# EAGLE design Camera (EAGLE 9.6.2)
COMPANY: ADAFRUIT INDUSTRIES; DRAWN: KTOWN; REV: A
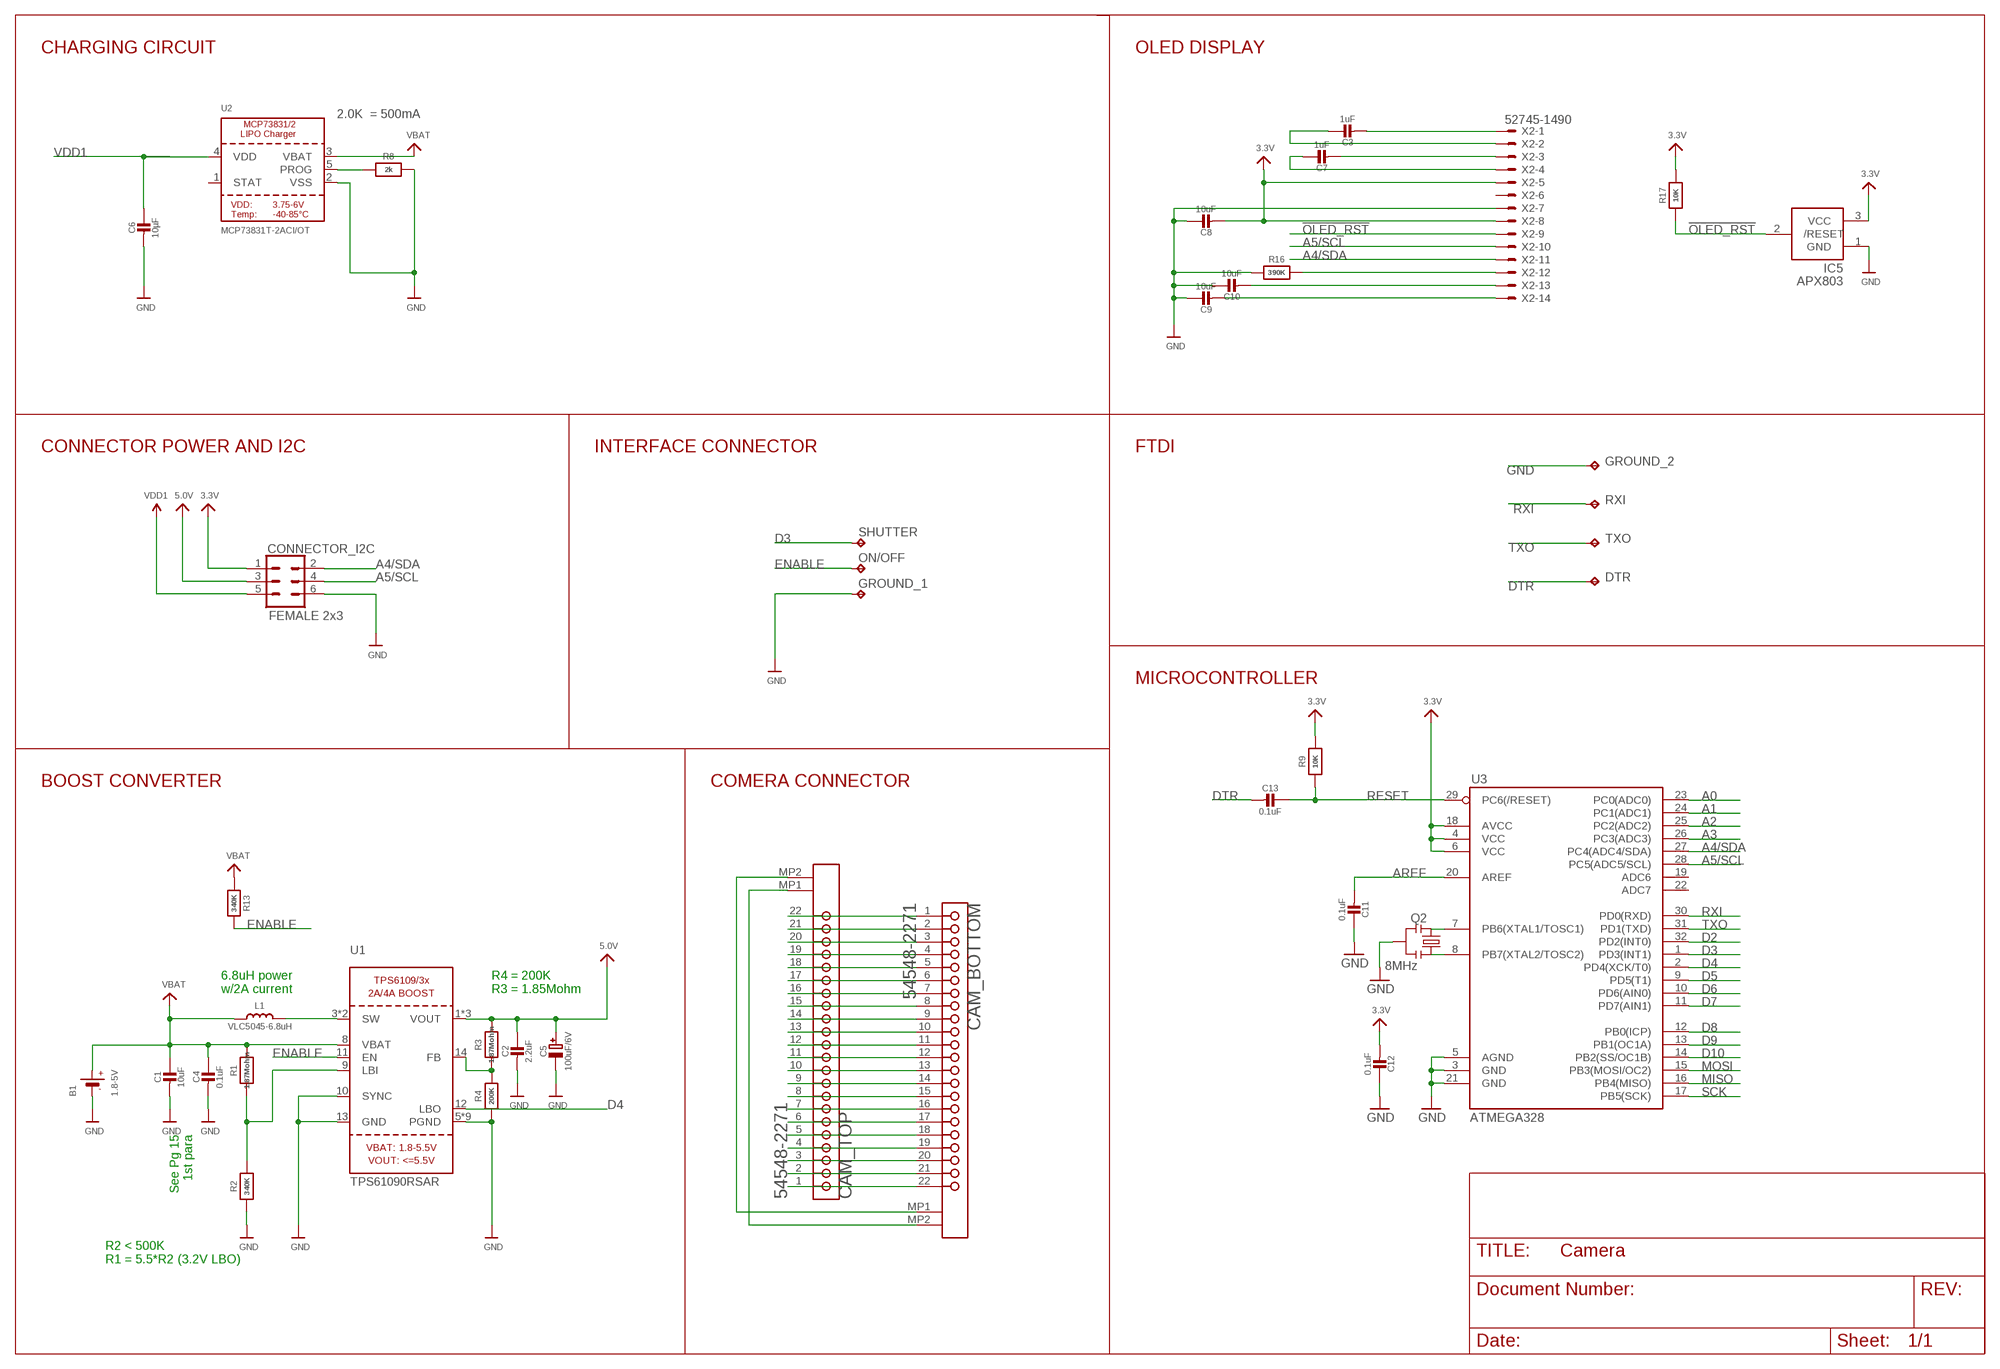
[diagram p0: schematic, sheet 1]

## Parts
B1  1.8-5V  BATTERY  [JSTPH2]
C1  10uF  CAP_CERAMIC0805-NOOUTLINE  [0805-NO]
C2  2.2uF  CAP_CERAMIC0805-NOOUTLINE  [0805-NO]
C3  1uF  CAP_CERAMIC0805-NOOUTLINE  [0805-NO]
C4  0.1uF  CAP_CERAMIC0805-NOOUTLINE  [0805-NO]
C5  100uF/6V  CAP_TANTALUMB/3528_REFLOW  [EIA3528-21/B-R]
C6  10µF  CAP_CERAMIC0805-NOOUTLINE  [0805-NO]
C7  1uF  CAP_CERAMIC0805-NOOUTLINE  [0805-NO]
C8  10uF  CAP_CERAMIC0805-NOOUTLINE  [0805-NO]
C9  10uF  CAP_CERAMIC0805-NOOUTLINE  [0805-NO]
C10  10uF  CAP_CERAMIC0805-NOOUTLINE  [0805-NO]
C11  0.1uF  CAP_CERAMIC0805-NOOUTLINE  [0805-NO]
C12  0.1uF  CAP_CERAMIC0805-NOOUTLINE  [0805-NO]
C13  0.1uF  CAP_CERAMIC0805-NOOUTLINE  [0805-NO]
CAM_BOTTOM  MOLEX_54548-2271MOLEX_54548-2271_0_0  [MOLEX_54548-2271_0]
CAM_TOP  MOLEX_54548-2271MOLEX_54548-2271_0_0  [MOLEX_54548-2271_0]
CONNECTOR_I2C  FEMALE 2x3  CONN_03X2FEMALE  [2X3]
DTR  TPB1,27  [B1,27]
GROUND_1  TPB1,27  [B1,27]
GROUND_2  TPB1,27  [B1,27]
IC5  APX803  AXP083-SAG  [SOT23]
L1  VLC5045-6.8uH  INDUCTORTDK_VLC5045  [INDUCTOR_5X5MM_TDK_VLC5045]
ON/OFF  TPB1,27  [B1,27]
Q2  8MHz  RESONATORSMD  [RESONATOR-SMD]
R1  1.87Mohm  RESISTOR0805_NOOUTLINE  [0805-NO]
R2  340K  RESISTOR0805_NOOUTLINE  [0805-NO]
R3  1.87Mohm  RESISTOR0805_NOOUTLINE  [0805-NO]
R4  200K  RESISTOR0805_NOOUTLINE  [0805-NO]
R8  2k  RESISTOR0805_NOOUTLINE  [0805-NO]
R9  10K  RESISTOR0805_NOOUTLINE  [0805-NO]
R13  340K  RESISTOR0805_NOOUTLINE  [0805-NO]
R16  390K  RESISTOR0805_NOOUTLINE  [0805-NO]
R17  10K  RESISTOR0805_NOOUTLINE  [0805-NO]
RXI  TPB1,27  [B1,27]
SHUTTER  TPB1,27  [B1,27]
TXO  TPB1,27  [B1,27]
U1  TPS61090RSAR  VREG_TPS6103X  [PVQFN-16]
U2  MCP73831T-2ACI/OT  MCP73831/2  [SOT23-5]
U3  ATMEGA328  ATMEGA168  [TQFP32-08]
X2  52745-1490  [52745-1490]

## Nets
3.3V: C8.2 C12.2 CONNECTOR_I2C.1 IC5.3(VCC) R9.2 R17.2 U3.4(VCC) U3.6(VCC) U3.18(AVCC) X2.5 X2.8
5.0V: C2.1 C5.+ CONNECTOR_I2C.3 R3.2 U1.1(VOUT) U1.15(VOUT) U1.16(VOUT)
!OLED_RST: IC5.2(/RESET) R17.1 X2.9
A0: U3.23(PC0(ADC0))
A1: U3.24(PC1(ADC1))
A2: U3.25(PC2(ADC2))
A3: U3.26(PC3(ADC3))
A4/SDA: CONNECTOR_I2C.2 U3.27(PC4(ADC4/SDA)) X2.11
A5/SCL: CONNECTOR_I2C.4 U3.28(PC5(ADC5/SCL)) X2.10
AREF: C11.2 U3.20(AREF)
D2: U3.32(PD2(INT0))
D3: SHUTTER.TP U3.1(PD3(INT1))
D4: U1.12(LBO) U3.2(PD4(XCK/T0))
D5: U3.9(PD5(T1))
D6: U3.10(PD6(AIN0))
D7: U3.11(PD7(AIN1))
D8: U3.12(PB0(ICP))
D9: U3.13(PB1(OC1A))
D10: U3.14(PB2(SS/OC1B))
DTR: C13.2 DTR.TP
ENABLE: ON/OFF.TP R13.2 U1.11(EN)
GND: B1.1(-) C1.2 C2.2 C4.2 C5.- C6.2 C8.1 C9.1 C10.1 C11.1 C12.1 CONNECTOR_I2C.6 GROUND_1.TP GROUND_2.TP IC5.1(GND) Q2.2 R2.1 R4.1 R8.2 R16.1 U1.5(PGND) U1.6(PGND) U1.7(PGND) U1.10(SYNC) U1.13(GND) U1.P$18(PGND) U1.P$19(PGND) U1.P$20(PGND) U1.P$21(PGND) U1.P$22(PGND) U1.THERMAL(PGND) U2.2(VSS) U3.3(GND) U3.5(AGND) U3.21(GND) X2.7
MISO: U3.16(PB4(MISO))
MOSI: U3.15(PB3(MOSI/OC2))
N$1: L1.P$2 U1.3(SW) U1.4(SW)
N$2: CAM_BOTTOM.MP1 CAM_TOP.MP2
N$3: R1.1 R2.2 U1.9(LBI)
N$4: CAM_BOTTOM.MP2 CAM_TOP.MP1
N$5: R3.1 R4.2 U1.14(FB)
N$6: CAM_BOTTOM.1 CAM_TOP.22
N$7: CAM_BOTTOM.2 CAM_TOP.21
N$8: R8.1 U2.5(PROG)
N$9: CAM_BOTTOM.3 CAM_TOP.20
N$10: CAM_BOTTOM.4 CAM_TOP.19
N$11: C3.2 X2.1
N$12: C3.1 X2.2
N$13: C7.2 X2.3
N$14: C7.1 X2.4
N$15: C10.2 X2.13
N$16: R16.2 X2.12
N$17: C9.2 X2.14
N$18: Q2.1 U3.8(PB7(XTAL2/TOSC2))
N$19: Q2.3 U3.7(PB6(XTAL1/TOSC1))
N$20: CAM_BOTTOM.5 CAM_TOP.18
N$21: CAM_BOTTOM.6 CAM_TOP.17
N$22: CAM_BOTTOM.7 CAM_TOP.16
N$23: CAM_BOTTOM.8 CAM_TOP.15
N$24: CAM_BOTTOM.9 CAM_TOP.14
N$25: CAM_BOTTOM.10 CAM_TOP.13
N$26: CAM_BOTTOM.11 CAM_TOP.12
N$27: CAM_BOTTOM.12 CAM_TOP.11
N$28: CAM_BOTTOM.13 CAM_TOP.10
N$29: CAM_BOTTOM.14 CAM_TOP.9
N$30: CAM_BOTTOM.15 CAM_TOP.8
N$31: CAM_BOTTOM.16 CAM_TOP.7
N$32: CAM_BOTTOM.17 CAM_TOP.6
N$33: CAM_BOTTOM.18 CAM_TOP.5
N$34: CAM_BOTTOM.19 CAM_TOP.4
N$35: CAM_BOTTOM.20 CAM_TOP.3
N$36: CAM_BOTTOM.21 CAM_TOP.2
N$37: CAM_BOTTOM.22 CAM_TOP.1
RESET: C13.1 R9.1 U3.29(PC6(/RESET))
RXI: RXI.TP U3.30(PD0(RXD))
SCK: U3.17(PB5(SCK))
TXO: TXO.TP U3.31(PD1(TXD))
VBAT: B1.2(+) C1.1 C4.1 L1.P$1 R1.2 R13.1 U1.8(VBAT) U2.3(VBAT)
VDD1: C6.1 CONNECTOR_I2C.5 U2.4(VDD) ; supply symbol labelled VCC
Unconnected: U2.1(STAT) U3.19(ADC6) U3.22(ADC7) X2.6

## Notes on the sheet
- CHARGING CIRCUIT | OLED DISPLAY
- 2.0K  = 500mA
- CONNECTOR POWER AND I2C | INTERFACE CONNECTOR | FTDI
- MICROCONTROLLER
- BOOST CONVERTER | COMERA CONNECTOR
- 6.8uH power
  w/2A current
- R4 = 200K
  R3 = 1.85Mohm
- See Pg 15
  1st para
- R2 < 500K
  R1 = 5.5*R2 (3.2V LBO)

## Library data of the parts
B1 = microbuilder:BATTERY: CR1220 SMT - Digikey: 3001K-ND CD2032 BAT-HLD-001 - Digikey: BAT-HLD-001-ND
C1-C4 C6-C13 = microbuilder:CAP_CERAMIC: Ceramic Capacitors For new designs, use the packages preceded by an '_' character since they are more reliable: The following footprints should be used on most boards: _0402 - Standard footprint for regular board layouts _0603 - Standard footprint for regular board layouts _0805 - Standard footprint for regular board layouts _1206 - Standard footprint for regular board layouts For extremely tight-pitch boards where space is at a premium, the following 'micro-pitch' footprints can be used (smaller pads, no silkscreen outline, etc.): _0402MP - Micro-pitch footprint for very dense/compact boards _0603MP - Micro-pitch footprint for very dense/compact boards _0805MP - Micro-pitch footprint for very dense/compact boards _1206MP - Micro-pitch footprint for very dense/compact boards
C5 = microbuilder:CAP_TANTALUM: Tantalum Capacitors Wave footprints have larger pads and are meant to be used for hand soldering. Reflow footprints are optimised for solder paste and a reflow oven. EIA3216-18/A-[R/W] - Size A / 3216-18 / 1206 footprint 4.7µF 25V 10% Tantalum Capacitor 10µF 16V 10% Tantalum Capacitor [Digikey: 495-2236-2-ND] EIA3528-21/B-[R/W] - Size B / 3528-21 47µF 10V 10% Tantalum Capactior [Digikey: 495-2216-1-ND] EIA6032-28/C-[R/W] - Size C / 6032-28 10µF 35V 20% Tantalum Capacitor [Digikey: 495-2285-1-ND] 100µF 16V 10% Tantalum Capactior [Digikey: 399-5214-1-ND]
CAM_BOTTOM CAM_TOP = Molex - 54548-2271:MOLEX_54548-2271: MOLX-54548-2271; CIIVA_IDS: 3405268; CIRCUITS_LOADED: 22; COMPONENT_LINK_1_DESCRIPTION: Manufacturer URL; COMPONENT_LINK_1_URL: http://www.molex.com/molex/index.jsp; COMPONENT_LINK_3_DESCRIPTION: Package Specification; COMPONENT_LINK_3_URL: http://www.molex.com/pdm_docs/sd/545482171_sd.pdf; CONTACT_POSITION: Bottom; CURRENT_MAX_PER_CONTACT: 0.5A; DATASHEET: http://www.molex.com/webdocs/datasheets/pdf/en-us/0545482271_FFC_FPC_CONNECTORS.pdf; DURABILITY_MATING_CYCLES_MAX: 20; ENTRY_ANGLE: 90degrees Angle; FOOTPRINT_VARIANT_NAME_0: Manufacturer Recommended; IMPORTED: yes; IMPORTED_FROM: vault; IMPORT_TS: 1521842921; MATED_HEIGHT: 1.20mm; MATERIAL___METAL: Phosphor Bronze; MATERIAL___PLATING_MATING: Gold; MATERIAL___PLATING_TERMINATION: Tin; MF: Molex; MOUNTING_TECHNOLOGY: Surface Mount; MPN: 54548-2271; NUMBER_OF_ROWS: 1; ORIENTATION: Right Angle; PACKAGE: 54548-2271; PACKAGE_DESCRIPTION: 22-Lead FPC Connector, Pitch 0.5 mm; PACKAGE_VERSION: Rev. N, 06/2008; PACKING: Tape and Reel; PCB_LOCATOR: No; PCB_RETENTION: Yes; PITCH___MATING_INTERFACE: 0.50mm; POLARIZED_TO_PCB: Yes; PREFIX: J; RELEASE_DATE: 1411372733; ROHS: Yes; STACKABLE: No; VAULT_GUID: 920E7395-0F54-4537-85AD-D56E07D5A003; VAULT_REVISION: 20E50B2D-1E80-4777-BC1D-DF1542527B45; VOLTAGE_MAX: 50V
CONNECTOR_I2C = SparkFun-Connectors:CONN_03X2: Multi connection point. Often used as Generic Header-pin footprint for 0.1 inch spaced/style header connections You can populate with any combo of single row headers, but if you'd like an exact match, check these: Header - 2x3 (Male, 0.1") <https://www.sparkfun.com/products/12807> (PRT-12807) Header - 2x3 (Female, 0.1") <https://www.sparkfun.com/products/13010> (PRT-13010) 2x3 Pin Shrouded Header <https://www.sparkfun.com/products/10877> (PRT-10877) On any of the 0.1 inch spaced packages, you can populate with these: Break Away Headers - Straight <https://www.sparkfun.com/products/116> (PRT-00116) Break Away Male Headers - Right Angle <https://www.sparkfun.com/products/553> (PRT-00553) Female Headers <https://www.sparkfun.com/products/115> (PRT-00115) Break Away Headers - Machine Pin <https://www.sparkfun.com/products/117> (PRT-00117) Break Away Female Headers - Swiss Machine Pin <https://www.sparkfun.com/products/743> (PRT-00743) Special note: the shrouded connector mates well with our 3x2 ribbon cables: Ribbon Crimp Connector - 6-pin (2x3, Female) <https://www.sparkfun.com/products/10651> (PRT-10651) Ribbon Cable - 6 wire (15ft) <https://www.sparkfun.com/products/10646> (PRT-10646); PROD_ID: CONN-11566
DTR GROUND_1 GROUND_2 ON/OFF RXI SHUTTER TXO = testpad:TP: Test pad
IC5 = adafruit:AXP083
L1 = microbuilder:INDUCTOR: Inductors 0603: 10nH Ceramic Inductor - microwire antenna/RF (Digikey: 712-1434-2-ND) 0805: 560nH Ceramic Inductor - RF (Digikey: 553-1047-1-ND) 270nH Ceramic Inductor - Q = 40@250MHz, +-5%, 1 Ohm DC Resistance (Digikey: 535-10506-2-ND) 1007 (2518 Metric) SMT: 10µH 10% 250mOhm 820mA 1007 Inductor (Digikey: 587-2189-1-ND) 22µH 10% 500mOhm 580mA 1007 Inductor (Digikey: 587-2190-1-ND) 47µH 10% 950mOhm 420mA 1007 Inductor (Digikey: 587-2191-1-ND) 47µH 5% 100mOhm 1A 1008 Inductor (Digikey: 732-1816-1-ND) 5.0x5.0mm (Taiyo Yuden NR5040 Series) 6.8µH 20% 2.3A 64mOhm Inductor (Digikey: 587-2374-2-ND) 5.0x5.0mm (TDK VLC5045 Series) 4.7µH 20% 3.3A 34mOhm Inductor (Digikey: 445-6526-1-ND) 6.8µH 20% 2.7A 46mOhm Inductor (Digikey: 445-6527-1-ND) 6.0x6.0mm (TDK VLC6045 Series) 4.7µH 20% 3.8A 27mOhm Inductor (Digikey: 445-6538-2-ND) 6.8µH 20% 3A 41mOhm Inductor (Digikey: 445-6540-1-ND) 6.2µH 30% 2.2A 45mOhm Inductor (Digikey: SRR5028-6R2YCT-ND) - Not TDK VLC6045 but footprint should match 6.0x6.0mm (TDK SLF6045 Series) 6.8uH 30% 2A 33mOhm Inductor (Digikey: 445-4572-1-ND, Mouser: 810-SLF645T6R8N2R0PF) 6.0x6.0mm (Sumida CDRH5D28 Series) 6.2uH 30% 1.8A 45mOhm Inductor (Digikey: 308-1542-1-ND) Taiyo Yuden NR3015T2R2M - 2.2uH 20% 1.5A (Digikey: 587-1648-2-ND, Mouser: 963-NR3015T2R2M) - Used with TI TPS62172 CoilCraft RFID Transponder Coil - MA5532-AE (For use with AS3935 Lightning Sensor)
Q2 = SparkFun:RESONATOR: Resonator Small SMD resonator. This is the itty bitty 10/20MHz resonators with built in caps. CSTCE10M0G55 and CSTCE20M0V53. Footprint has been reviewed closely but hasn't been tested yet.
R1-R4 R8 R9 R13 R16 R17 = microbuilder:RESISTOR: Resistors For new designs, use the packages preceded by an '_' character since they are more reliable: The following footprints should be used on most boards: _0402 - Standard footprint for regular board layouts _0603 - Standard footprint for regular board layouts _0805 - Standard footprint for regular board layouts _1206 - Standard footprint for regular board layouts For extremely tight-pitch boards where space is at a premium, the following 'micro-pitch' footprints can be used (smaller pads, no silkscreen outline, etc.): _0402MP - Micro-pitch footprint for very dense/compact boards _0603MP - Micro-pitch footprint for very dense/compact boards _0805MP - Micro-pitch footprint for very dense/compact boards _1206MP - Micro-pitch footprint for very dense/compact boards
U1 = microbuilder:VREG_TPS6103X: TPS6103x 4A Boost - 1.8-5.5V Input, Adjustable Output to 5.5V
U2 = microbuilder:MCP73831/2: MCP73831/2 LIPO Charger VDD: 3.75 - 6V Temp -40 - 85°C Programmable Charge Rate: 15-500mA NOTE: STAT is a tri-state logic output on the MCP73831 and an open-drain output on the MCP73832. SOT23-5 with 4.2V output and tri-state logic on STAT = MCP73831T-2ACI/OT
U3 = SparkFun:ATMEGA168
X2 = con-molex:52745-1490: FFC/FPC-to-Board 0.50mm (.020") SMT Top Contact Right Angle, ZIF, Style Receptacle 52745 / 52435 Source: http://www.molex.com/product/ffc/52745.html; MF: WALDOM/MOLEX; MPN: 52745-1490; OC_FARNELL: unknown; OC_NEWARK: 38C9888

## Net classes
0 default: width 0.203 mm
1 vcc: width 0.254 mm

## Board
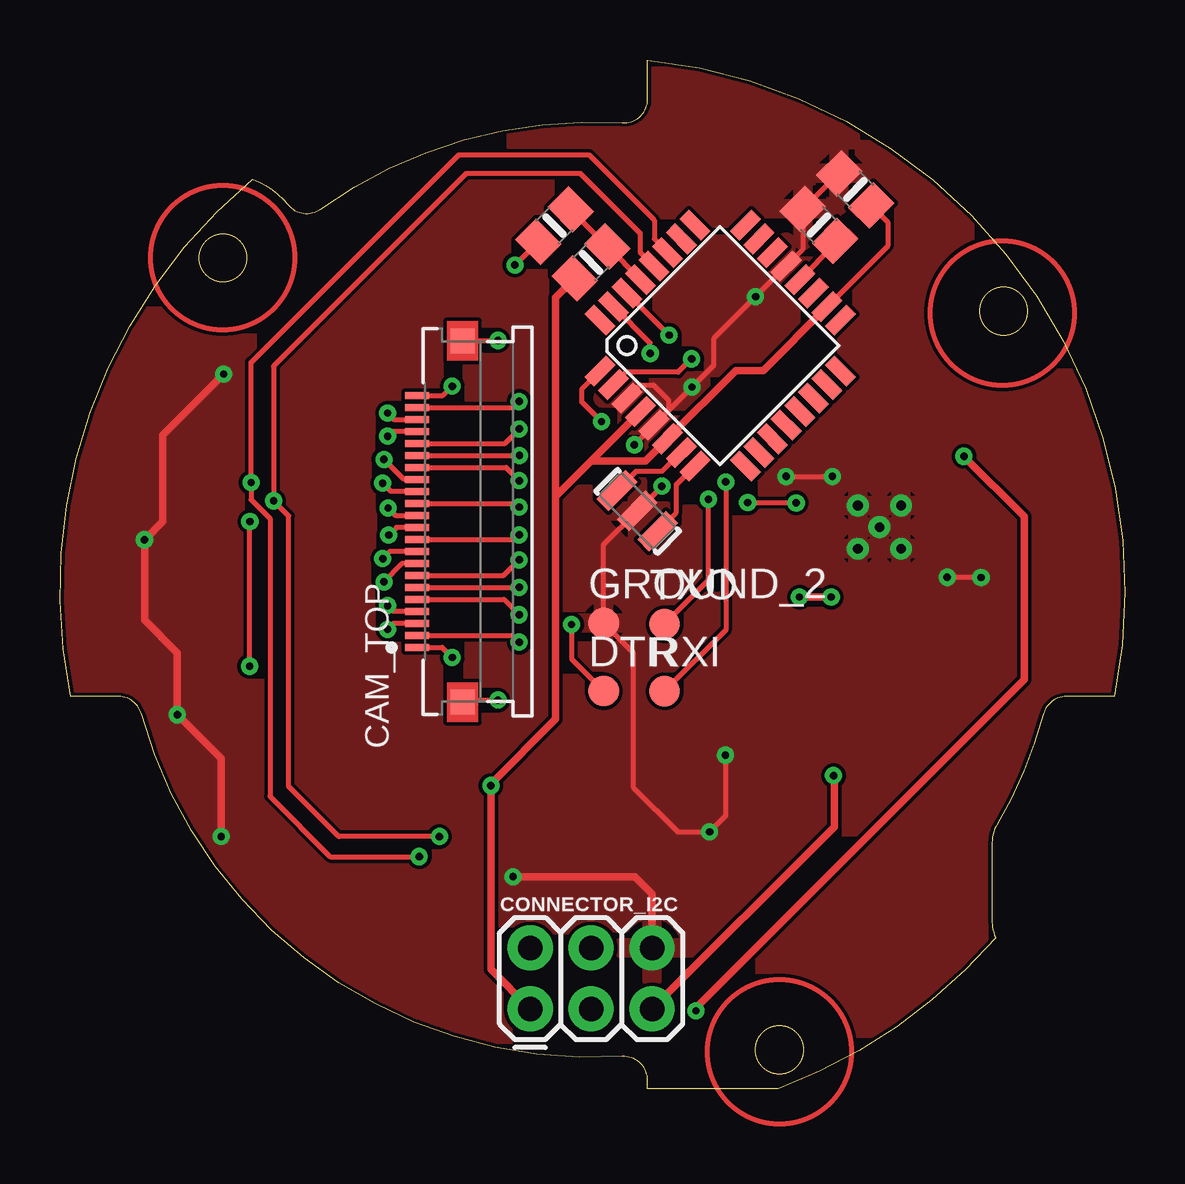
[diagram p1: board, top side]
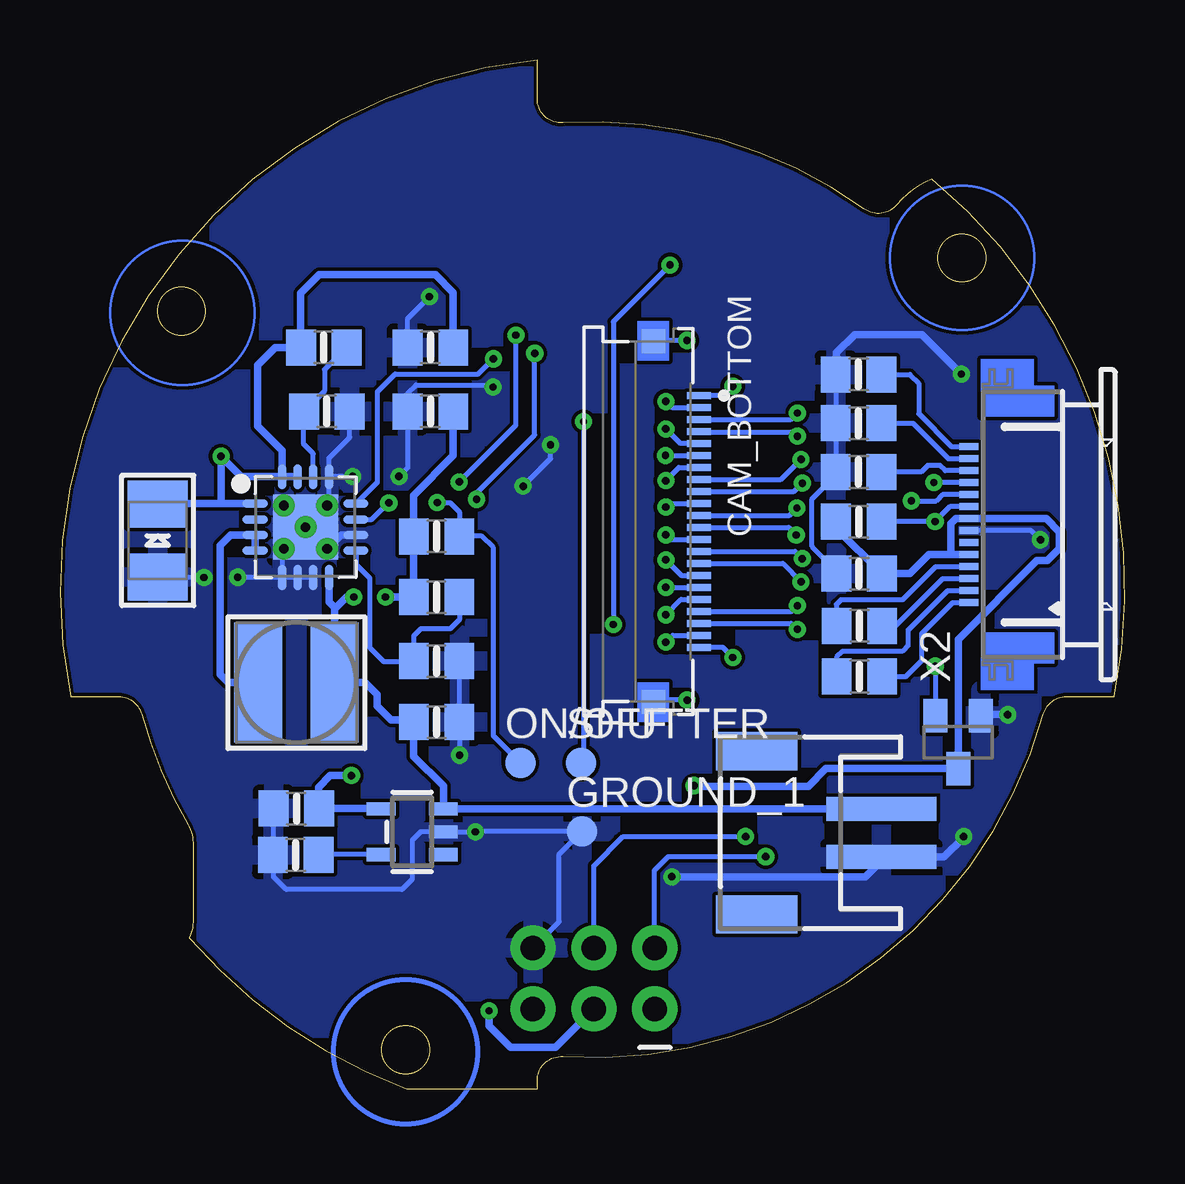
[diagram p2: board, bottom side, seen from below]

Size 44.39 x 42.88 mm. Coordinates in mm from the lower left corner, seen from the top.
Outline: 24.5,41.26 24.5,42.88 arc-96 43.94,16.35 41.96,16.35 arc75 40.99,15.62 arc-15 39.06,11 arc30 38.85,10.25 38.85,6.95 arc26 39,6.3 arc-29 29.95,0 24.5,0 24.5,0.34 arc94 23.43,1.34 arc-78 3.4,15.62 arc75 2.43,16.35 0.45,16.35 arc-62 8.04,37.9 arc-30 9.5,36.85 arc86 10.86,36.67 arc-39 23.43,40.26 arc94 24.5,41.26
Outline: circle at 6.79,34.63 radius 1
Outline: circle at 29.99,1.62 radius 1
Outline: circle at 39.33,32.41 radius 1
Copper layers (1*16): Top 0.035mm / dielectric 1.5mm / Bottom 0.035mm
Design rules "default *": minimum track width 6mil, minimum drill 8mil, track to track 6mil, track to pad 6mil, pad to pad 6mil, via to via 6mil, smd to smd 6mil, copper to edge 6mil, drill to drill 6mil, minimum pad ring 10mil, minimum via ring 8mil, stop-mask expansion 4mil, vias tented up to drill 12mil, thermal gap 10mil

### Footprints (pad centres in the part's own frame; a part is rotated, then mirrored left to right if it is on the bottom)
JSTPH2 = smd 1 x 4.6: 1 -1,-3.7; 2 1,-3.7 | smd 1.6 x 3.4: NC1 -3.4,1.5; NC2 3.4,1.5
0805-NO = smd 1.24 x 1.5: 1 -0.95,0; 2 0.95,0
EIA3528-21/B-R = smd 1.95 x 2.5: + 1.525,0; - -1.525,0
MOLEX_54548-2271_0 = smd 0.3 x 1: 1 -5.25,0.95; 2 -4.75,0.95; 3 -4.25,0.95; 4 -3.75,0.95; 5 -3.25,0.95; 6 -2.75,0.95; 7 -2.25,0.95; 8 -1.75,0.95; 9 -1.25,0.95; 10 -0.75,0.95; 11 -0.25,0.95; 12 0.25,0.95; 13 0.75,0.95; 14 1.25,0.95; 15 1.75,0.95; 16 2.25,0.95; 17 2.75,0.95; 18 3.25,0.95; 19 3.75,0.95; 20 4.25,0.95; 21 4.75,0.95; 22 5.25,0.95 | smd 1 x 1: MP1 -7.525,-0.95; MP2 7.525,-0.95
2X3 = drill 1.016 pad 1.88: 1 0,0; 2 0,2.54; 3 2.54,0; 4 2.54,2.54; 5 5.08,0; 6 5.08,2.54
B1,27 = smd 1.27 x 1.27: TP 0,0
SOT23 = smd 1 x 1.4: 1 -0.95,-1.1; 2 0.95,-1.1; 3 0,1.1
INDUCTOR_5X5MM_TDK_VLC5045 = smd 2 x 5: P$1 -1.6,0; P$2 1.6,0
RESONATOR-SMD = smd 0.7 x 1.7: 1 -1.2,0; 2 0,0; 3 1.2,0
PVQFN-16 = smd 1.05 x 0.35: 1 -2.1,0.975; 2 -2.1,0.325; 3 -2.1,-0.325; 4 -2.1,-0.975; 9 2.1,-0.975; 10 2.1,-0.325; 11 2.1,0.325; 12 2.1,0.975 | smd 0.35 x 1.05: 5 -0.975,-2.1; 6 -0.325,-2.1; 7 0.325,-2.1; 8 0.975,-2.1; 13 0.975,2.1; 14 0.325,2.1; 15 -0.325,2.1; 16 -0.975,2.1 | drill 0.4: P$18 0,0; P$19 -0.9,0.9; P$20 0.9,0.9; P$21 0.9,-0.9; P$22 -0.9,-0.9 | smd 2.7 x 2.7: THERMAL 0,0
SOT23-5 = smd 0.55 x 1.2: 1 -0.95,-1.3; 2 0,-1.3; 3 0.95,-1.3; 4 0.95,1.3; 5 -0.95,1.3
TQFP32-08 = smd 1.27 x 0.559: 1 -4.293,2.8; 2 -4.293,2; 3 -4.293,1.2; 4 -4.293,0.4; 5 -4.293,-0.4; 6 -4.293,-1.2; 7 -4.293,-2; 8 -4.293,-2.8; 17 4.293,-2.8; 18 4.293,-2; 19 4.293,-1.2; 20 4.293,-0.4; 21 4.293,0.4; 22 4.293,1.2; 23 4.293,2; 24 4.293,2.8 | smd 0.559 x 1.27: 9 -2.8,-4.293; 10 -2,-4.293; 11 -1.2,-4.293; 12 -0.4,-4.293; 13 0.4,-4.293; 14 1.2,-4.293; 15 2,-4.293; 16 2.8,-4.293; 25 2.8,4.293; 26 2,4.293; 27 1.2,4.293; 28 0.4,4.293; 29 -0.4,4.293; 30 -1.2,4.293; 31 -2,4.293; 32 -2.8,4.293
52745-1490 = smd 0.3 x 0.8: 1 -3.25,2.5; 2 -2.75,2.5; 3 -2.25,2.5; 4 -1.75,2.5; 5 -1.25,2.5; 6 -0.75,2.5; 7 -0.25,2.5; 8 0.25,2.5; 9 0.75,2.5; 10 1.25,2.5; 11 1.75,2.5; 12 2.25,2.5; 13 2.75,2.5; 14 3.25,2.5

### Placement (x,y rotation side)
B1  13.85,10.67 90 bottom
C1  28.95,28.23 180 bottom
C2  28.95,30.9 180 bottom
C3  11.07,17.18 0 bottom
C4  28.7,15.28 0 bottom
C5  40.32,22.85 90 bottom
C6  34.54,11.67 180 bottom
C7  11.07,19.29 0 bottom
C8  11.08,21.46 0 bottom
C9  11.11,29.77 0 bottom
C10  11.11,27.74 0 bottom
C11  31.63,36 315 top
C12  33.15,37.49 315 top
C13  20.61,35.98 225 top
CAM_BOTTOM  18.71,23.64 270 bottom
CAM_TOP  15.83,23.64 90 top
CONNECTOR_I2C  19.6,3.33 0 top
DTR  22.67,16.58 0 top
GROUND_1  22.64,10.72 0 bottom
GROUND_2  22.67,19.41 0 top
IC5  6.96,14.45 180 bottom
L1  34.54,16.93 180 bottom
ON/OFF  25.21,13.58 0 bottom
Q2  24.06,24.08 135 top
R1  28.7,20.49 180 bottom
R2  28.7,17.82 180 bottom
R3  33.4,30.9 180 bottom
R4  33.27,28.23 180 bottom
R8  34.57,9.74 180 bottom
R9  22.13,34.44 225 top
R13  28.7,23.03 0 bottom
R16  11.11,25.71 0 bottom
R17  11.1,23.63 180 bottom
RXI  25.21,16.57 0 top
SHUTTER  22.67,13.58 0 bottom
TXO  25.21,19.37 0 top
U1  34.16,23.41 0 bottom
U2  29.71,10.71 90 bottom
U3  27.52,30.97 45 top
X2  4,23.51 90 bottom

### Tracks (layer width: path | path; a pad name or v marks a point on that pad's centre or on a via)
3.3V  (via drill 0.3)
  Top 0.203: C12.2 34.51,36.13 34.51,35.12 31.98,32.59 U3.18
  Top 0.305: CONNECTOR_I2C.1 17.96,4.97 v17.96,12.63 17.96,12.71 20.67,15.41 20.67,24.69 | U3.18 29.31,29.94 28.18,29.94 U3.6 24.4,26.16 22.14,26.16 | R9.2 20.67,32.97 20.67,24.69 | 22.14,26.16 20.67,24.69 | U3.4 22.14,26.16
  Bottom 0.305: v17.96,12.63 17.85,12.75 17.71,12.61 13.2,12.61 12.47,13.35 IC5.3 6.96,18.73 3.67,22.02 3.24,22.02 2.73,22.52 2.73,23.21 3.28,23.76 X2.8 7.06,23.76 7.26,23.57 7.26,22.29 7.23,22.26 | R17.2 12.05,23.38 C8.2 8.98,21.46 8.18,22.26 7.23,22.26 | X2.5 7.23,22.26
5.0V  (via drill 0.3)
  Top 0.305: v26.51,3.25 26.51,3.37 40.2,17.06 40.2,23.84 v37.68,26.36
  Bottom 0.305: U1.1 37.68,24.38 | 37.68,24.38 40.31,24.38 C5.+ | U1.16 35.13,26.6 36.16,27.63 36.16,30.17 35.43,30.9 R3.2 34.36,30.91 34.36,33.17 33.6,33.93 28.74,33.93 28,33.19 C2.1 | U1.16 U1.15 | CONNECTOR_I2C.3 23.75,1.72 25.62,1.72 26.51,2.61 v26.51,3.25 | 37.68,24.38 v37.68,26.36 36.83,25.51 U1.16
!OLED_RST  (via drill 0.3)
  Top 0.203: v7.9,17.61 7.9,23.63 v7.92,23.64
  Bottom 0.152: R17.1
  Bottom 0.203: v7.9,17.61 v7.91,17.61 IC5.2 | R17.1 v7.92,23.64 7.29,24.26 X2.9
A4/SDA  (via drill 0.3)
  Top 0.203: U3.27 24.77,35.42 24.77,36.2 22.04,38.93 16.63,38.93 7.97,30.27 v7.97,25.27 7.97,24.56 8.75,23.77 8.75,12.19 11.27,9.67 v14.98,9.67
  Bottom 0.152: 19.63,5.89 CONNECTOR_I2C.2
  Bottom 0.203: v14.98,9.67 19.04,9.67 19.63,9.09 19.63,5.89 | X2.11 v7.96,25.26 v7.97,25.27
A5/SCL  (via drill 0.3)
  Top 0.203: U3.28 24.18,34.88 24.18,35.66 21.7,38.15 16.93,38.15 8.91,30.12 v8.91,24.51 9.54,23.87 9.54,12.59 11.62,10.51 v15.82,10.51
  Bottom 0.203: CONNECTOR_I2C.4 22.14,9.29 20.92,10.51 v15.82,10.51 | X2.10 7.61,24.76 7.87,24.51 v8.91,24.51
AREF
  Top 0.203: U3.20 32.3,35.19 C11.2
D3  (via drill 0.3)
  Top 0.203: v22.57,27.81 21.74,28.64 21.74,29.16 U3.1
  Bottom 0.152: SHUTTER.TP 22.57,13.68
  Bottom 0.203: v22.57,27.81 22.57,13.68
D4  (via drill 0.3)
  Top 0.203: U3.2 23.58,29.86 25.77,29.86 v26.33,30.42
  Bottom 0.203: U1.12 31.16,25.29 31.16,29.05 30.42,29.79 26.97,29.79 v26.33,30.42
DTR  (via drill 0.3)
  Top 0.203: DTR.TP 21.33,17.92 v21.33,19.35 | v18.96,34.34 v18.97,34.34 C13.2
  Bottom 0.203: v21.33,19.35 21.33,31.97 v18.96,34.34
ENABLE  (via drill 0.3)
  Top 0.152: 28.68,24.42 v28.67,24.43
  Top 0.203: v30.69,24.42 28.68,24.42
  Bottom 0.152: R13.2 | 30.7,24.43 v30.69,24.42
  Bottom 0.203: ON/OFF.TP 26.33,14.71 26.33,22.55 26.81,23.03 R13.2 | U1.11 31.4,23.73 30.7,24.43 | v28.67,24.43 28.13,24.43 27.75,24.04 R13.2
GND  (via drill 0.3)
  Top 0.203: v30.27,25.52 v32.2,25.52 | U3.3 24.18,29.33 24.73,29.33 25.37,28.7 25.37,28.25 U3.5 | v27.74,13.9 27.74,11.36 v27.08,10.7 25.76,10.7 23.89,12.57 23.89,18.18 GROUND_2.TP 22.67,22.69 Q2.2 v25.09,25.11 | C12.1 31,36.68 C11.1 30.96,34.98 U3.21 v29,33.02 27.25,31.27 27.25,30.14 v26.34,29.24 U3.5 | v23.94,26.84 v23.95,26.84 U3.5 | v38.4,21.3 38.38,21.32 v36.99,21.32
  Top 0.305: v6.72,10.51 6.72,13.76 v4.89,15.59 4.89,18.16 3.52,19.53 v3.52,22.88 4.28,23.64 4.28,27.25 v6.82,29.79 | CONNECTOR_I2C.6 24.68,8.12 23.97,8.83 v18.89,8.83
  Bottom 0.152: v27.08,10.7 27.09,10.71 27.08,10.72 | 33.17,25.52 U1.13 | R8.2 35.49,9.77 | 6.72,10.48 v6.72,10.51 | 5.96,15.59 IC5.1 | 27.75,13.92 v27.75,13.91 v27.74,13.9 | C8.1 12.03,21.59 | GROUND_1.TP
  Bottom 0.203: 27.09,10.71 U2.2 29.36,10.71 29.71,10.36 29.71,8.73 30.14,8.3 34.97,8.3 35.49,8.82 35.49,9.77 C6.2 | U1.7 U1.6 U1.5 | U1.THERMAL 33.18,24.38 U1.13 33.18,26.29 32.32,27.15 R4.1 | v30.27,25.52 29.9,25.89 C1.2 29.9,28.99 29.56,29.33 26.43,29.33 v26.34,29.24 | v32.2,25.52 33.17,25.52 | C2.2 29.9,32.11 v29,33.02 | 27.08,10.72 GROUND_1.TP 23.59,9.77 23.59,6.96 CONNECTOR_I2C.6 | B1.1 10,9.67 | C9.1 C10.1 R16.1 12.06,25.57 13.05,24.58 13.05,22.61 12.03,21.59 | R2.1 C4.2 27.75,13.92 | v25.09,25.11 23.94,26.26 v23.94,26.84 | C5.- 38.41,21.32 v38.4,21.3 | U1.P$22 35.14,22.43 U1.5 | U1.5 v36.98,21.31 v36.99,21.32 | v3.52,22.88 3.91,23.26 X2.7
  Bottom 0.305: U1.10 32.68,23.08 U1.P$21 U1.THERMAL | U1.THERMAL U1.P$20 | U1.THERMAL 34.49,23.41 34.66,23.24 35.06,23.63 U1.P$19 | U1.THERMAL U1.P$22 | 6.72,10.48 7.54,9.67 10,9.67 10.83,8.83 v18.89,8.83 | v4.89,15.59 5.96,15.59 | C9.1 12.03,29.8 12.03,30.68 11.27,31.44 8.47,31.44 v6.82,29.79
  pour Bottom: -0.42,-0.56 44.78,-0.56 44.78,42.62 -0.42,42.62
  pour Top: -2.96,-3.1 -2.96,45.16 45.32,45.16 45.32,-3.1
N$1
  Bottom 0.305: L1.P$2 37.37,16.93 37.71,17.27 37.71,22.65 37.28,23.08 U1.3 U1.4
N$2  (via drill 0.3)
  Top 0.203: CAM_TOP.MP2 16.8,31.19 v18.25,31.19 v18.26,31.19
  Bottom 0.203: v18.26,31.19 19.63,31.19 CAM_BOTTOM.MP1
N$3
  Bottom 0.152: 29.67,17.8 R2.2
  Bottom 0.203: U1.9 32.06,21.85 31.49,21.28 31.49,18.38 30.9,17.8 29.67,17.8 | R1.1 27.75,19.56 28.13,19.17 29.35,19.17 29.65,18.88 R2.2
N$4  (via drill 0.3)
  Top 0.203: CAM_TOP.MP1 16.86,16.2 v18.25,16.2
  Bottom 0.203: v18.25,16.2 19.58,16.2 CAM_BOTTOM.MP2
N$5
  Bottom 0.152: 34.23,28.22 R4.2
  Bottom 0.203: U1.14 33.83,26.47 34.23,26.87 34.23,28.22 | R3.1 33.37,29.98 33.37,29.09 R4.2
N$6  (via drill 0.3)
  Top 0.203: CAM_TOP.22 15.96,28.89 v16.35,29.28
  Bottom 0.203: CAM_BOTTOM.1 16.74,28.89 v16.35,29.28
N$7  (via drill 0.3)
  Top 0.203: CAM_TOP.21 18.89,28.39 v19.14,28.65
  Bottom 0.203: v19.14,28.65 18.89,28.39 CAM_BOTTOM.2
N$8
  Bottom 0.152: 33.6,9.76 R8.1
  Bottom 0.203: U2.5 33.6,9.76
N$9  (via drill 0.3)
  Top 0.203: v13.66,28.16 13.93,27.89 CAM_TOP.20
  Bottom 0.203: v13.66,28.16 13.93,27.89 CAM_BOTTOM.3
N$10  (via drill 0.3)
  Top 0.203: v13.66,27.2 13.85,27.39 CAM_TOP.19
  Bottom 0.203: CAM_BOTTOM.4 17.75,27.38 13.83,27.38 v13.66,27.2
N$11
  Bottom 0.203: C3.2 9.14,17.18 8.47,17.85 8.47,18.97 7.18,20.26 X2.1
N$12
  Bottom 0.203: C3.1 12.02,17.99 11.78,18.23 9.29,18.23 9.03,18.49 9.03,19.12 7.39,20.76 X2.2
N$13
  Bottom 0.203: C7.2 9.57,19.29 7.6,21.26 X2.3
N$14
  Bottom 0.152: C7.1
  Bottom 0.203: C7.1 12.03,20.19 11.83,20.39 9.26,20.39 7.89,21.76 X2.4
N$15
  Bottom 0.203: C10.2 8.84,27.74 7.36,26.26 X2.13
N$16
  Bottom 0.203: X2.12 7.5,25.76 7.71,25.98 8.22,25.98 8.49,25.71 R16.2
N$17
  Bottom 0.203: C9.2 8.96,29.77 8.6,29.41 8.6,28.14 7.23,26.76 X2.14
N$18
  Top 0.203: U3.8 25.7,25.19 25.7,24.02 Q2.1
N$19
  Top 0.203: U3.7 25.1,25.72 24.01,25.72 Q2.3
N$20  (via drill 0.3)
  Top 0.203: v19.14,27.5 19.14,27.47 18.56,26.89 CAM_TOP.18
  Bottom 0.203: CAM_BOTTOM.5 18.52,26.89 v19.13,27.5 v19.14,27.5
N$21  (via drill 0.3)
  Top 0.203: v19.16,26.4 19.14,26.38 19.14,26.39 CAM_TOP.17
  Bottom 0.203: v19.16,26.4 CAM_BOTTOM.6
N$22  (via drill 0.3)
  Top 0.203: CAM_TOP.16 18.59,25.89 v19.14,25.34
  Bottom 0.203: v19.14,25.34 18.59,25.89 CAM_BOTTOM.7
N$23  (via drill 0.3)
  Top 0.203: v13.5,26.23 14.34,25.39 CAM_TOP.15
  Bottom 0.203: CAM_BOTTOM.8 14.34,25.39 v13.5,26.23
N$24  (via drill 0.3)
  Top 0.203: CAM_TOP.14 13.8,24.89 v13.45,25.24
  Bottom 0.203: v13.45,25.24 13.8,24.89 CAM_BOTTOM.9
N$25  (via drill 0.3)
  Top 0.203: v19.14,24.25 19,24.39 CAM_TOP.13
  Bottom 0.203: v19.14,24.25 19,24.39 CAM_BOTTOM.10
N$26  (via drill 0.3)
  Top 0.203: v13.68,24.2 13.99,23.89 CAM_TOP.12
  Bottom 0.203: CAM_BOTTOM.11 13.99,23.89 v13.68,24.2
N$27  (via drill 0.3)
  Top 0.203: v13.71,23.08 14.02,23.39 CAM_TOP.11
  Bottom 0.203: CAM_BOTTOM.12 14.02,23.39 13.68,23.05 13.71,23.05 v13.71,23.08
N$28  (via drill 0.3)
  Top 0.203: CAM_TOP.10 18.95,22.89 v19.14,23.08
  Bottom 0.203: v19.14,23.08 18.95,22.89 CAM_BOTTOM.13
N$29  (via drill 0.3)
  Top 0.203: CAM_TOP.9 13.76,22.4 v13.45,22.09
  Bottom 0.203: CAM_BOTTOM.14 13.75,22.39 v13.45,22.09
N$30  (via drill 0.3)
  Top 0.203: v13.5,21.13 14.27,21.89 CAM_TOP.8
  Bottom 0.203: CAM_BOTTOM.15 14.27,21.89 v13.5,21.13
N$31  (via drill 0.3)
  Top 0.203: CAM_TOP.7 18.49,21.39 v19.14,22.04
  Bottom 0.203: v19.14,22.04 18.49,21.39 CAM_BOTTOM.16
N$32  (via drill 0.3)
  Top 0.203: CAM_TOP.6 v19.14,20.89 v19.14,20.9
  Bottom 0.203: v19.14,20.9 v19.14,20.89 CAM_BOTTOM.17
N$33  (via drill 0.3)
  Top 0.203: CAM_TOP.5 18.51,20.39 v19.14,19.76
  Bottom 0.203: v19.14,19.76 18.51,20.39 CAM_BOTTOM.18
N$34  (via drill 0.3)
  Top 0.203: v13.66,20.14 13.9,19.89 CAM_TOP.4
  Bottom 0.203: CAM_BOTTOM.19 13.9,19.89 v13.66,20.14
N$35  (via drill 0.3)
  Top 0.203: CAM_TOP.3 13.91,19.4 v13.66,19.15
  Bottom 0.203: v13.66,19.15 13.91,19.4 CAM_BOTTOM.20
N$36  (via drill 0.3)
  Top 0.203: CAM_TOP.2 18.86,18.89 v19.14,18.61
  Bottom 0.203: CAM_BOTTOM.21 18.85,18.9 19.13,18.61 v19.14,18.61
N$37  (via drill 0.3)
  Top 0.203: CAM_TOP.1 15.93,18.39 v16.35,17.98
  Bottom 0.203: v16.35,17.98 16.76,18.39 CAM_BOTTOM.22
RESET
  Top 0.203: C13.1 R9.1 U3.29
RXI  (via drill 0.3)
  Top 0.203: RXI.TP 27.75,19.12 v27.75,25.29 | U3.30 25.38,31.41 v25.39,31.41
  Bottom 0.203: v27.75,25.29 25.39,27.65 v25.39,31.41
TXO  (via drill 0.3)
  Top 0.152: 27.04,24.58 v27.03,24.57
  Top 0.203: TXO.TP 27.04,21.2 27.04,24.58 | v24.6,30.65 24.6,31.08 23.09,32.59 U3.31
  Bottom 0.203: v27.03,24.57 27.03,24.82 24.6,27.25 v24.6,30.65
VBAT  (via drill 0.3)
  Top 0.305: v30.83,20.49 v32.15,20.49
  Bottom 0.305: B1.2 U2.3 | U2.3 | C1.1 28,26.39 29.66,24.73 29.66,23.04 R13.1 R1.2 30.64,20.49 30.65,20.49 v30.83,20.49 | U1.8 33.18,20.28 32.93,20.03 | U2.3 28.41,12.61 29.65,13.85 C4.1 29.73,15.36 30.6,15.36 31.18,15.95 31.18,16.43 31.68,16.93 L1.P$1 32.94,20.03 32.93,20.03 | v32.15,20.49 32.45,20.49 32.88,20.06 32.88,20.09 32.93,20.03
VDD1  (via drill 0.3)
  Top 0.305: CONNECTOR_I2C.5 32.27,10.92 32.27,13.02 v32.25,13.05
  Bottom 0.152: U2.4 31.03,11.67
  Bottom 0.305: 31.03,11.67 C6.1 33.62,11.7 33.62,12.57 33.14,13.05 v32.25,13.05
(copper drawn outside any net)
  shapes: Bottom circle x3, Top circle x3